# Altium schematic sheet Ethernet.SchDoc: WZ1262 - WIZnet Connect the Magic 2014 Design Challenge
size A4; DocumentNumber: 2; Revision: 1.0; SheetNumber: 2; SheetTotal: 4
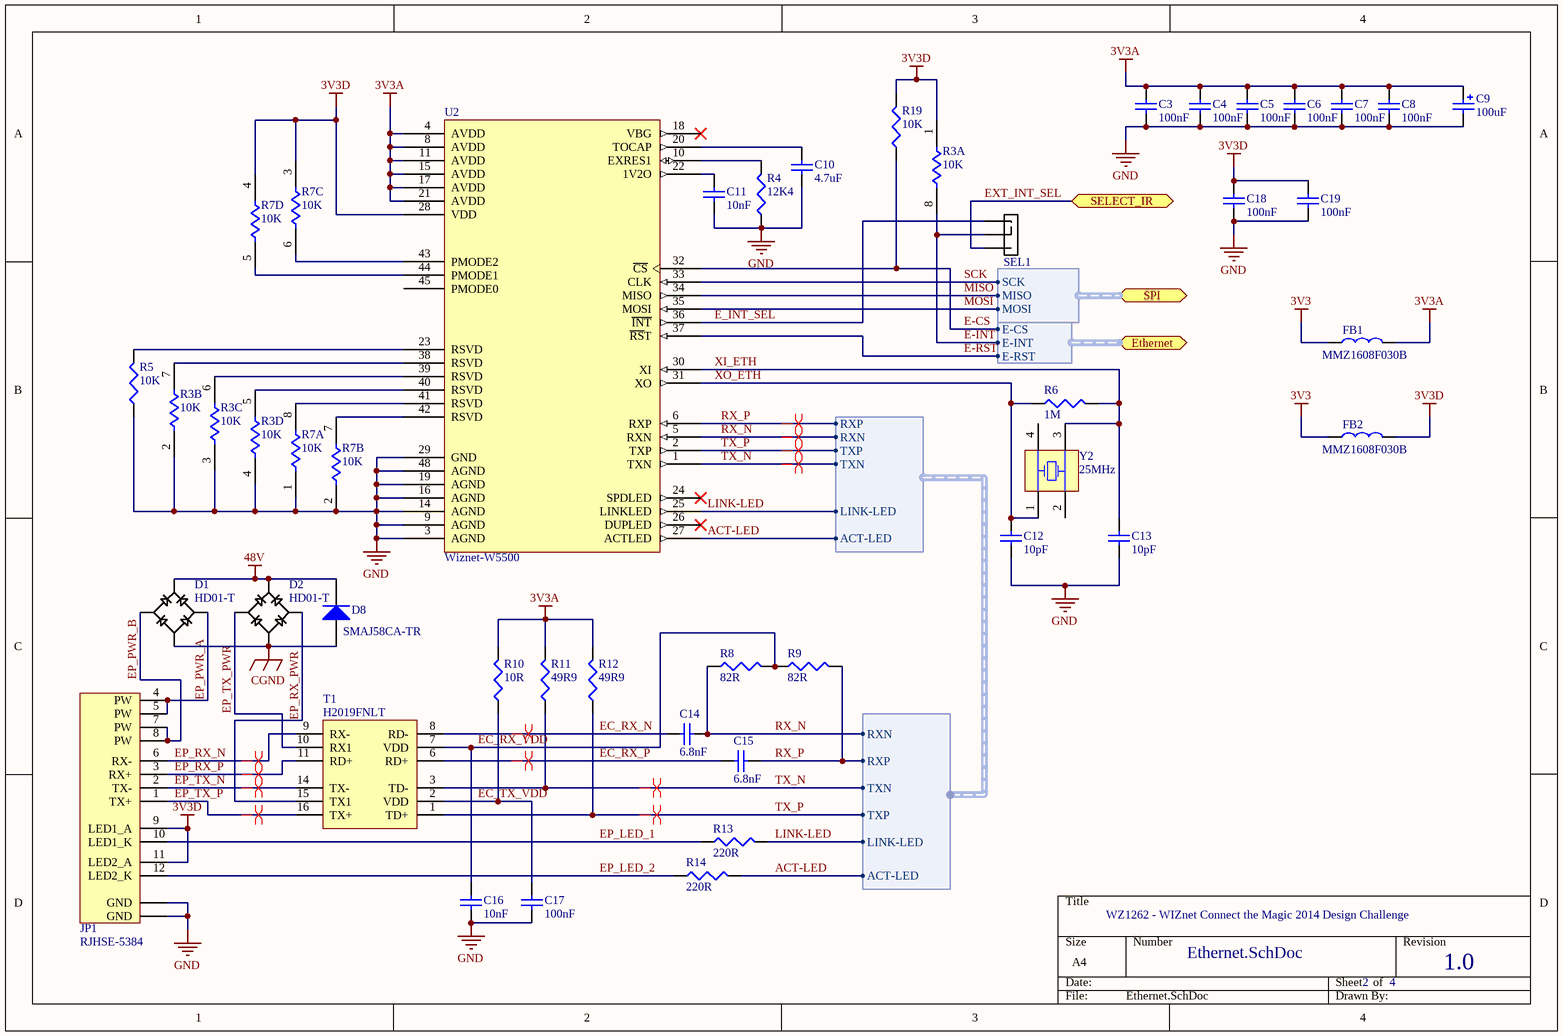
[diagram p0: Ethernet.SchDoc]

## Parts
C3  100nF  [0603]
C4  100nF  [0603]
C5  100nF  [0603]
C6  100nF  [0603]
C7  100nF  [0603]
C8  100nF  [0603]
C9  100uF  [PANASONIC_C]
C10  4.7uF  [0603]
C11  10nF  [0603]
C12  10pF  [0603]
C13  10pF  [0603]
C14  6.8nF  [0603]
C15  6.8nF  [0603]
C16  10nF  [0603]
C17  100nF  [0603]
C18  100nF  [0603]
C19  100nF  [0603]
D1  HD01-T  [MBS]
D2  HD01-T  [MBS]
D8  SMAJ58CA-TR  [SMBJ]
FB1  MMZ1608F030B  [0603]
FB2  MMZ1608F030B  [0603]
JP1  RJHSE-5384  [RJHSE-5484]
R3  10K  [SO8_S]  (parts A,B,C,D of 4)
R4  12K4  [0603]
R5  10K  [0603]
R6  1M  [0603]
R7  10K  [SO8_S]  (parts A,B,C,D of 4)
R8  82R  [0603]
R9  82R  [0603]
R10  10R  [0603]
R11  49R9  [0603]
R12  49R9  [0603]
R13  220R  [0603]
R14  220R  [0603]
R19  10K  [0603]
SEL1  SELECTOR  [SJ_3_PASTE2&3]  (value not drawn)  (no BOM)
T1  H2019FNLT  [HXXXX]
U2  Wiznet-W5500  [QFN48]
Y2  25MHz  [CRYSTAL-SMD-2.5X2-ABM10]

## Ports
Ethernet (harness Ethernet), SELECT_IR, SPI (harness SPI)

## Harnesses
SPI: SCK, MISO, MOSI
Ethernet: E-CS, E-INT, E-RST
RJ45: RXP, RXN, TXP, TXN, LINK-LED, ACT-LED

## Nets
3V3: FB1.1 FB2.1
3V3A: C3.2 C4.2 C5.2 C6.2 C7.2 C8.2 C9.+ FB1.2 R10.2 R11.2 R12.2 U2.4(AVDD) U2.8(AVDD) U2.11(AVDD) U2.15(AVDD) U2.17(AVDD) U2.21(AVDD)
3V3D: C18.2 C19.2 FB2.2 JP1.9(LED1_A) JP1.11(LED2_A) R3.1 R7.3 R7.4 R19.2 U2.28(VDD)
48V: D1.+ D2.+ D8.2(K)
CGND: D1.- D2.- D8.1(A)
GND: C3.1 C4.1 C5.1 C6.1 C7.1 C8.1 C9.- C10.1 C11.1 C12.1 C13.1 C16.1 C17.1 C18.1 C19.1 JP1.GND1(GND) JP1.GND2(GND) R3.2 R3.3 R3.4 R4.1 R5.1 R7.1 R7.2 U2.3(AGND) U2.9(AGND) U2.14(AGND) U2.16(AGND) U2.19(AGND) U2.29(GND) U2.48(AGND)
ACT-LED: R14.2 U2.27(ACTLED) ; harness RJ45.ACT-LED
E-CS: R19.1 U2.32(~{CS}) ; port Ethernet.E-CS
E-INT: R3.8 SEL1.2 ; port Ethernet.E-INT
E-RST: U2.37(~{RS}T) ; port Ethernet.E-RST
E_INT_SEL: SEL1.3 U2.36(~{INT})
EC_RX_N: C14.1 T1.8(RD-)
EC_RX_P: C15.1 T1.6(RD+)
EC_RX_VDD: C16.2 R8.2 R9.1 T1.7(VDD)
EC_TX_VDD: C17.2 R10.1 T1.2(VDD)
EP_LED_1: JP1.10(LED1_K) R13.1
EP_LED_2: JP1.12(LED2_K) R14.1
EP_PWR_A: D1.AC2 JP1.4(PW) JP1.5(PW)
EP_PWR_B: D1.AC1 JP1.7(PW) JP1.8(PW)
EP_RX_N: JP1.6(RX-) T1.9(RX-)
EP_RX_P: JP1.3(RX+) T1.11(RD+)
EP_RX_PWR: D2.AC2 T1.15(TX1)
EP_TX_N: JP1.2(TX-) T1.14(TX-)
EP_TX_P: JP1.1(TX+) T1.16(TX+)
EP_TX_PWR: D2.AC1 T1.10(RX1)
EXT_INT_SEL: SEL1.1 ; port SELECT_IR
LINK-LED: R13.2 U2.25(LINKLED) ; harness RJ45.LINK-LED
MISO: U2.34(MISO) ; port SPI.MISO
MOSI: U2.35(MOSI) ; port SPI.MOSI
RX_N: C14.2 R8.1 U2.5(RXN) ; harness RJ45.RXN
RX_P: C15.2 R9.2 U2.6(RXP) ; harness RJ45.RXP
SCK: U2.33(CLK) ; port SPI.SCK
TX_N: R11.1 T1.3(TD-) U2.1(TXN) ; harness RJ45.TXN
TX_P: R12.1 T1.1(TD+) U2.2(TXP) ; harness RJ45.TXP
XI_ETH: C13.2 R6.2 U2.30(XI) Y2.3(OSC2)
XO_ETH: C12.2 R6.1 U2.31(XO) Y2.1(OSC1)
NetC10_2: C10.2 U2.20(TOCAP)
NetC11_2: C11.2 U2.22(1V2O)
NetR3_5: R3.5 U2.40(RSVD)
NetR3_6: R3.6 U2.39(RSVD)
NetR3_7: R3.7 U2.38(RSVD)
NetR4_2: R4.2 U2.10(EXRES1)
NetR5_2: R5.2 U2.23(RSVD)
NetR7_5: R7.5 U2.44(PMODE1)
NetR7_6: R7.6 U2.43(PMODE2)
NetR7_7: R7.7 U2.42(RSVD)
NetR7_8: R7.8 U2.41(RSVD)

Not connected (* = marked no-connect by the designer): U2 18(VBG)* 24(SPDLED)* 26(DUPLED)* 45(PMODE0); Y2 2(OSC2) 4(OSC1)

## Layout directives
differential pair: EC_RX_N, EC_RX_P, EP_RX_N, EP_RX_P, EP_TX_N, EP_TX_P, RX_N, RX_P, TX_N, TX_P

## Library data of the parts
C3-C8 C18 C19 = Cap_100pF: Capacitor (Semiconductor SIM Model); Value: 100pF; Published: 8-Jun-2000; LatestRevisionDate: 29-May-2009; LatestRevisionNote: IPC-7351 Footprint Added.; PackageReference: C1206; Publisher: Altium Limited; PackageDescription: Chip Capacitor; Supplier 1: Digi-Key; Supplier Part Number 1: 399-1096-1-ND; Supplier 2: Mouser; Supplier Part Number 2: 80-C0603C104K3R
C9 = Cap_Polarized_100uF: Polarized Capacitor (Surface Mount); Published: 8-Jun-2000; LatestRevisionDate: 29-May-2009; LatestRevisionNote: IPC-7351 Footprint Added.; PackageReference: C0805; Publisher: Altium Limited; PackageDescription: Chip Capacitor; Value: 100uF; Supplier 1: Digi-Key; Supplier 2: Mouser; Supplier Part Number 1: PCE4718CT-ND; Supplier Part Number 2: 667-EEE-HAJ101WAR
C10 = Cap_4.7uF: Capacitor (Semiconductor SIM Model); Published: 8-Jun-2000; LatestRevisionDate: 29-May-2009; LatestRevisionNote: IPC-7351 Footprint Added.; PackageReference: C1206; Publisher: Altium Limited; PackageDescription: Chip Capacitor; Value: 4.7uF; Supplier 1: Digi-Key; Supplier 2: Mouser; Supplier Part Number 1: 1276-2087-1-ND; Supplier Part Number 2: 80-C0603C475M8P
C11 C16 = Cap_10nF: Capacitor (Semiconductor SIM Model); Published: 8-Jun-2000; LatestRevisionDate: 29-May-2009; LatestRevisionNote: IPC-7351 Footprint Added.; PackageReference: C1206; Publisher: Altium Limited; PackageDescription: Chip Capacitor; Value: 10nF; Supplier 1: Digi-Key; Supplier 2: Mouser; Supplier Part Number 1: 1276-1927-1-ND; Supplier Part Number 2: 77-VJ0603Y103KXAAC; Supplier 3: Digi-Key; Supplier Part Number 3: 399-1091-1-ND
C12 C13 = Cap_10pF: Capacitor (Semiconductor SIM Model); Published: 8-Jun-2000; LatestRevisionDate: 29-May-2009; LatestRevisionNote: IPC-7351 Footprint Added.; PackageReference: C1206; Publisher: Altium Limited; PackageDescription: Chip Capacitor; Value: 10pF; Supplier 1: Digi-Key; Supplier 2: Mouser; Supplier Part Number 1: 1276-2157-1-ND; Supplier Part Number 2: 80-C0603C100K3G
C14 C15 = Cap_6.8nF: Capacitor (Semiconductor SIM Model); Published: 8-Jun-2000; LatestRevisionDate: 29-May-2009; LatestRevisionNote: IPC-7351 Footprint Added.; PackageReference: C1206; Publisher: Altium Limited; PackageDescription: Chip Capacitor; Value: 6.8nF; Supplier 1: Digi-Key; Supplier 2: Mouser; Supplier Part Number 1: 1276-2103-1-ND; Supplier Part Number 2: 77-VJ0603Y682MXQPBC
C17 = Cap_100nF: Capacitor (Semiconductor SIM Model); Published: 8-Jun-2000; LatestRevisionDate: 29-May-2009; LatestRevisionNote: IPC-7351 Footprint Added.; PackageReference: C1206; Publisher: Altium Limited; PackageDescription: Chip Capacitor; Value: 100nF; Supplier 1: Digi-Key; Supplier 2: Mouser; Supplier Part Number 1: 399-1096-1-ND; Supplier Part Number 2: 80-C0603C104K3R
D1 D2 = Diode Bridge: Published: 8-Jun-2000; LatestRevisionDate: 29-May-2009; LatestRevisionNote: IPC-7351 Footprint Added.; PackageReference: J1-0603; Publisher: Altium Limited; PackageDescription: Chip Resistor; Value: -; Supplier 1: Digi-Key; Supplier 2: Mouser; Supplier Part Number 1: HD01DICT-ND; Supplier Part Number 2: 621-HD01-T
D8 = Diode_POWER: Default Diode; Published: 8-Jun-2000; LatestRevisionDate: 17-Jul-2002; LatestRevisionNote: Re-released for DXP Platform.; PackageVersion: Sep-1996; PackageReference: SMC; Publisher: Altium Limited; PackageDescription: DO-214-AB/SMC; 2 C-Bend Leads; Body 7.9 x 5.9 mm, inc. leads (LxW); Code_JEDEC: DO-214-AB; Supplier 1: Digi-Key; Supplier 2: Mouser; Supplier Part Number 1: 497-6509-1-ND; Supplier Part Number 2: 511-SMAJ58CA-TR
FB1 FB2 = Ferrite Bead: Value: HH-1M1608-121JT; Published: 8-Jun-2000; LatestRevisionDate: 29-May-2009; LatestRevisionNote: IPC-7351 Footprint Added.; PackageReference: J1-0603; Publisher: Altium Limited; PackageDescription: Chip Resistor; Supplier 1: Digi-Key; Supplier 2: Mouser; Supplier Part Number 1: 445-8676-1-ND; Supplier Part Number 2: 810-MMZ1608F030B
JP1 = Ethernet Socket: Ethernet Socket RJ45 With Leds; Supplier 1: Digi-Key; Supplier 2: Mouser; Supplier Part Number 1: RJHSE-5384-ND; Supplier Part Number 2: 523-RJHSE-5484
R3 R7 = Resistor_Pack_10K: Isolated Resistor Network - Parts; Sim Note: Enter the Resistance value into parameter field.; Published: 24-Mar-1999; LatestRevisionDate: 29-May-2009; LatestRevisionNote: IPC-7351 Footprint Added.; PackageReference: SOIC16; Publisher: Altium Limited; PackageDescription: 16-Pin Small Outline Integrated Circuit 1.27 mm Pitch; Code_JEDEC: MS-012-AC; Code_IPC: SOIC127P600-16; Value: 10K; Supplier 1: Digi-Key; Supplier 2: Mouser; Supplier Part Number 1: 742C083103JPCT-ND; Supplier Part Number 2: 774-742C083103JP
R4 = Resistor_12K4: Resistor; Published: 8-Jun-2000; LatestRevisionDate: 29-May-2009; LatestRevisionNote: IPC-7351 Footprint Added.; PackageReference: J1-0603; Publisher: Altium Limited; PackageDescription: Chip Resistor; Value: 12K4; Supplier 1: Digi-Key; Supplier 2: Mouser; Supplier Part Number 1: 1276-4752-1-ND; Supplier Part Number 2: 71-CRCW0603-12.4K-E3
R5 R19 = Resistor_10K: Resistor; Published: 8-Jun-2000; LatestRevisionDate: 29-May-2009; LatestRevisionNote: IPC-7351 Footprint Added.; PackageReference: J1-0603; Publisher: Altium Limited; PackageDescription: Chip Resistor; Value: 10K; Supplier 1: Digi-Key; Supplier 2: Mouser; Supplier Part Number 1: 311-10KGRCT-ND; Supplier Part Number 2: 603-AF0603FR-0710KL
R6 = Resistor_1M: Resistor; Published: 8-Jun-2000; LatestRevisionDate: 29-May-2009; LatestRevisionNote: IPC-7351 Footprint Added.; PackageReference: J1-0603; Publisher: Altium Limited; PackageDescription: Chip Resistor; Value: 1M; Supplier 1: Digi-Key; Supplier 2: Mouser; Supplier Part Number 1: 311-1MLMCT-ND; Supplier Part Number 2: 603-AF0603FR-071ML
R8 R9 = Resistor_82R: Resistor; Published: 8-Jun-2000; LatestRevisionDate: 29-May-2009; LatestRevisionNote: IPC-7351 Footprint Added.; PackageReference: J1-0603; Publisher: Altium Limited; PackageDescription: Chip Resistor; Value: 82R; Supplier 1: Digi-Key; Supplier 2: Mouser; Supplier Part Number 1: 311-82GRCT-ND; Supplier Part Number 2: 660-RK73H1JTTD82R0F
R10 = Resistor_10R: Resistor; Published: 8-Jun-2000; LatestRevisionDate: 29-May-2009; LatestRevisionNote: IPC-7351 Footprint Added.; PackageReference: J1-0603; Publisher: Altium Limited; PackageDescription: Chip Resistor; Value: 10R; Supplier 1: Digi-Key; Supplier 2: Mouser; Supplier Part Number 1: 1276-5014-1-ND; Supplier Part Number 2: 71-CRCW0603-10-E3
R11 R12 = Resistor_49R9: Resistor; Published: 8-Jun-2000; LatestRevisionDate: 29-May-2009; LatestRevisionNote: IPC-7351 Footprint Added.; PackageReference: J1-0603; Publisher: Altium Limited; PackageDescription: Chip Resistor; Value: 49R9; Supplier 1: Digi-Key; Supplier 2: Mouser; Supplier Part Number 1: RHM49.9CFCT-ND; Supplier Part Number 2: 660-RK73H1JTTD49R9F
R13 R14 = Resistor_220R: Resistor; Published: 8-Jun-2000; LatestRevisionDate: 29-May-2009; LatestRevisionNote: IPC-7351 Footprint Added.; PackageReference: J1-0603; Publisher: Altium Limited; PackageDescription: Chip Resistor; Value: 220R; Supplier 1: Digi-Key; Supplier 2: Mouser; Supplier Part Number 1: 311-220GRCT-ND; Supplier Part Number 2: 660-RK73H1JTTD2200F
SEL1 = SELECTOR: Solder Selector
T1 = Magnetics: Power over Ethernet Magnetic Module; Published: 24-Mar-1999; LatestRevisionDate: 17-Jul-2002; LatestRevisionNote: Re-released for DXP Platform.; PackageReference: MODULE5B; Publisher: Altium Limited; Supplier 1: Digi-Key; Supplier 2: Mouser; Supplier Part Number 2: 673-H2019FNLT
U2 = Wiznet-W5500: W5500 Fast SPI Ethernet Controller; Supplier 1: Digi-Key; Supplier Part Number 1: 1278-1021-ND; Supplier 2: Mouser; Supplier Part Number 2: 950-W5500; Code_JEDEC: MO-220-VHHD-2; ComponentLink1Description: Manufacturer Link; ComponentLink1URL: http://www.wiznet.co.kr/Sub_Modules/en/product/Product_Detail.asp?cate1=5&cate2=7&cate3=77&pid=1193
Y2 = Crystal_25MHz: Surface Mount Quartz Crystal; Note: PCB layout complies with manufacturer's recommendation.; Published: 17-Jul-2002; DatasheetDocument: 28-Aug-2001; PackageDocument: 28-Aug-2001; PackageReference: 91SMX; Publisher: Altium Limited; ComponentLink1Description: Manufacturer Link; ComponentLink1URL: http://www.cmac.com/mt/; ComponentLink2Description: Datasheet; ComponentLink2URL: http://www.cmac.com/mt/databook/crystals/smd/90_91_smx.pdf; Value: 25MHz; Supplier 1: Digi-Key; Supplier 2: Mouser; Supplier Part Number 1: 535-9095-1-ND; Supplier Part Number 2: 815-ABM10-25-E20-T